# Altium project Cell-Sentinel.PrjPcb
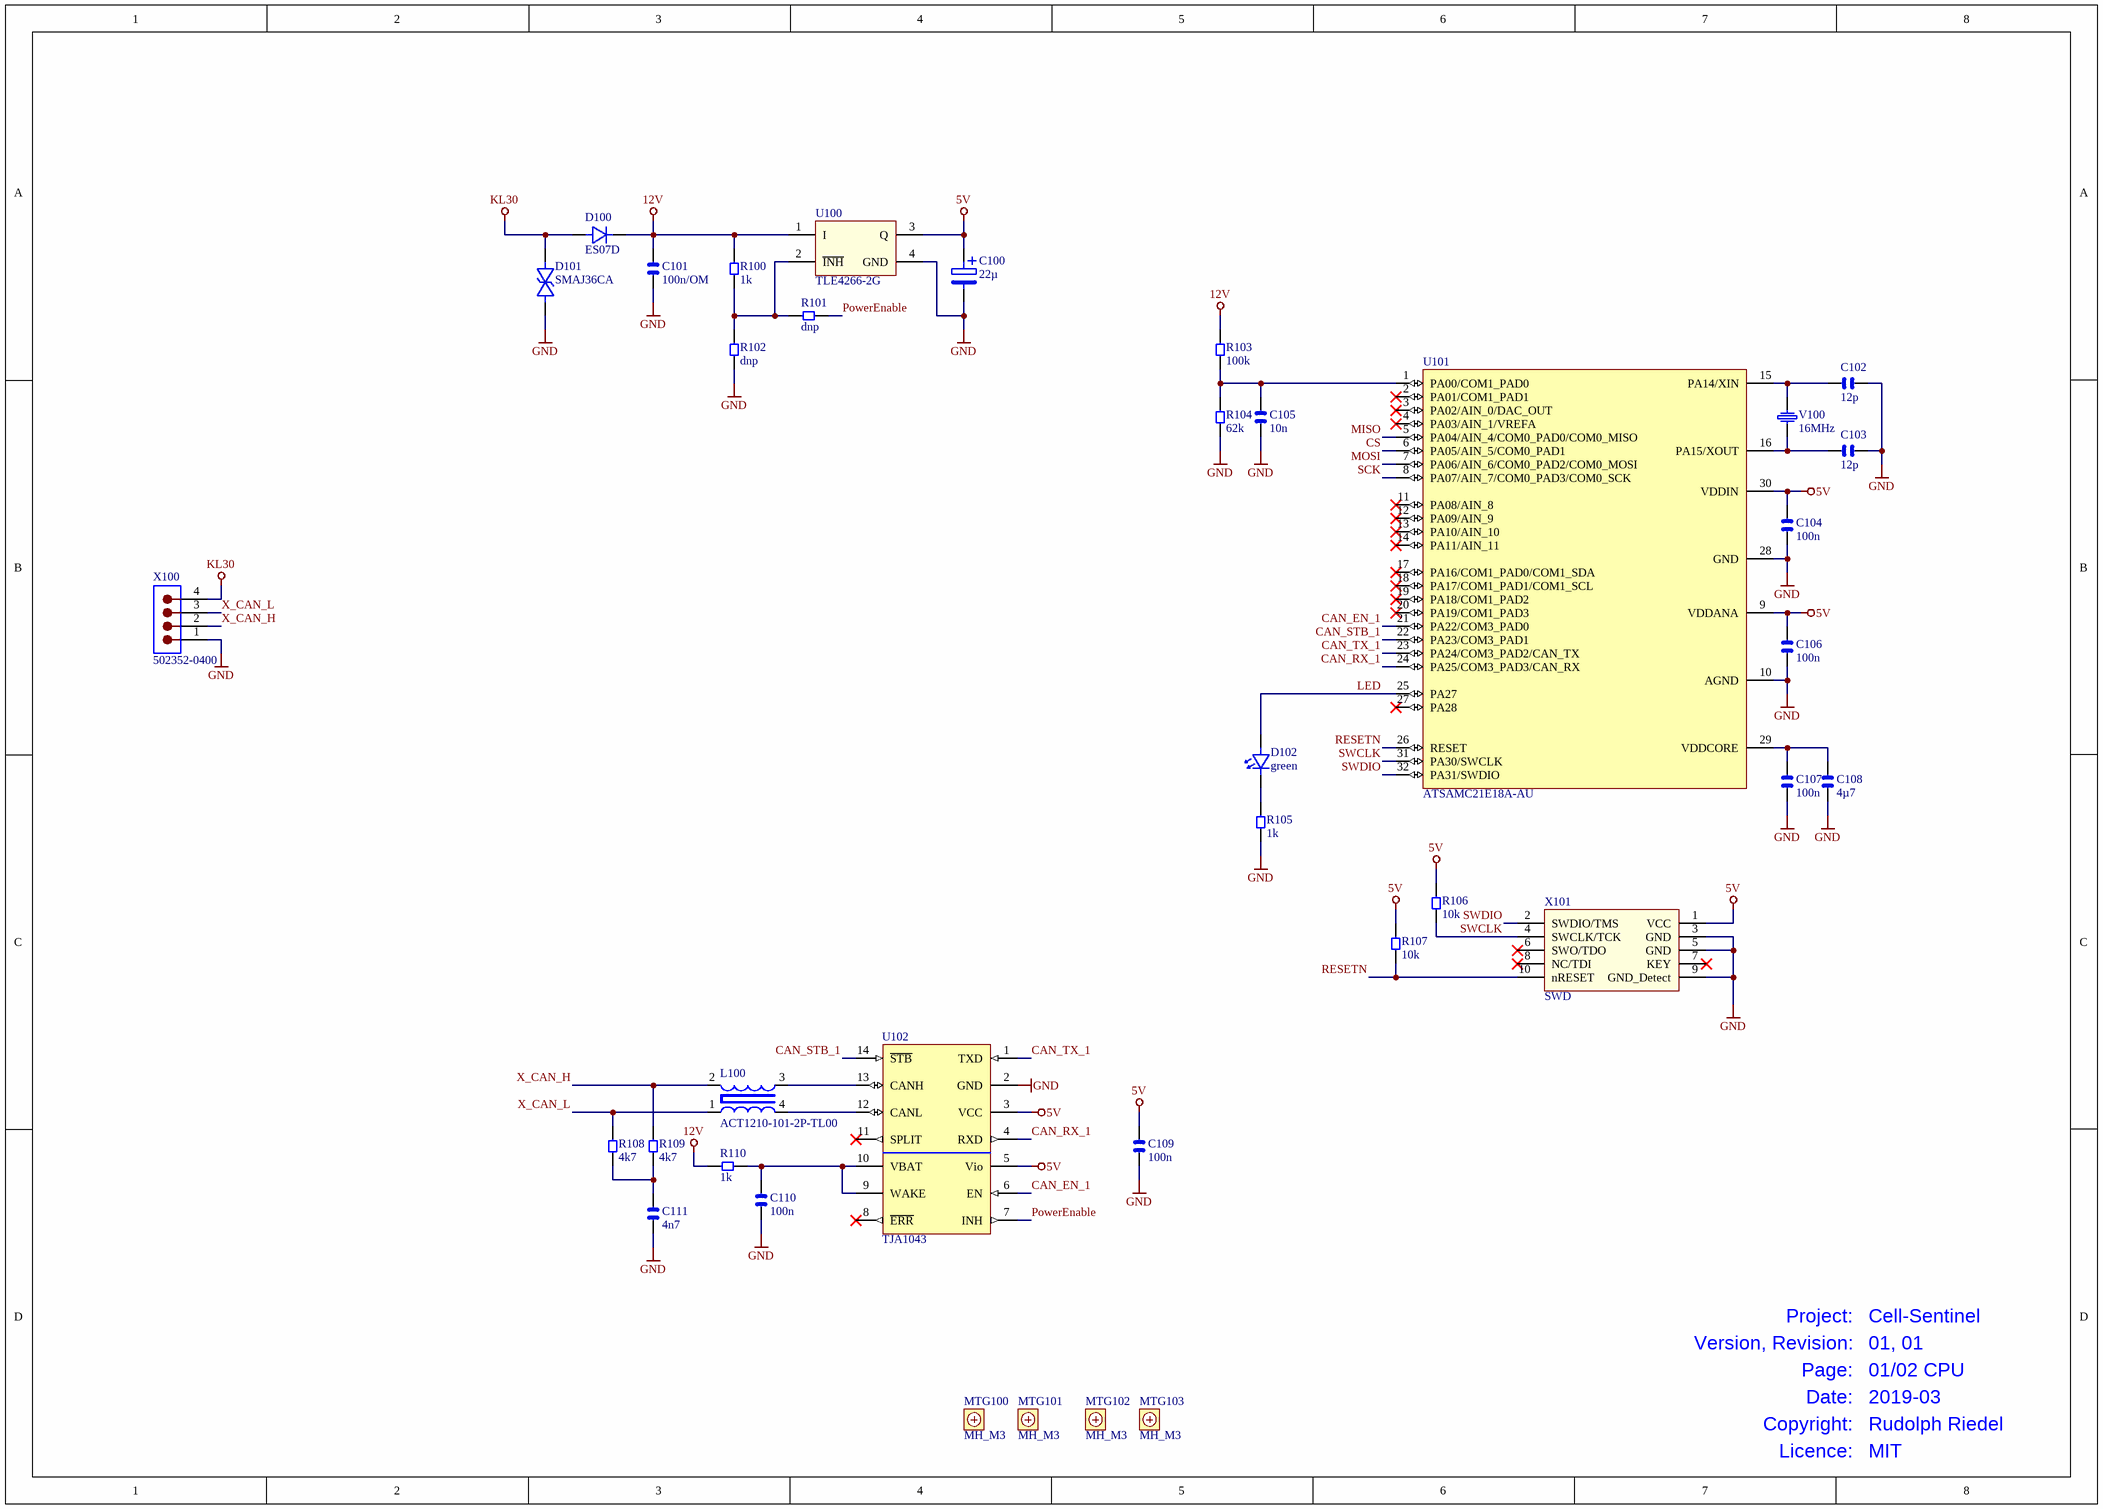
[diagram p0: 01_CPU.SchDoc]
2 sheets, 118 parts. Net scope: global (net labels, ports and power ports of the same name join across sheets).
Board file: CS_01-01.PcbDoc
Sheets:
  01_CPU.SchDoc
  02_Cell_Frontend.SchDoc

## Sheet 01_CPU.SchDoc: Sheet Description
size A3; Organization: Organization; Address1: Address1; Address2: Address2; Address3: Address3; Address4: Address4; DocumentNumber: 1; Revision: 0; SheetNumber: 1; SheetTotal: 2; PageSetup: Record=PageOptions|CenterHorizontal=True|CenterVertical=True|PrintScale=1.00|XCorrection=1.00|YCorrection=1.00|PrintKind=1|BorderSize=5000000|LeftOffset=0|BottomOffset=0|Orientation=2|PaperLength=1000|PaperWidth=1000|Scale=100|PaperSource=7|PrintQuality=-4|MediaType=1|DitherType=10|PaperKind=A3|PrintScaleMode=0

### Parts
C100  22µ  [CAPMP3528X21N]
C101  100n/OM  [CAPC2012X14L]
C102  12p  [CAPC2012X14L]
C103  12p  [CAPC2012X14L]
C104  100n  [CAPC1608X09L]
C105  10n  [CAPC2012X14L]
C106  100n  [CAPC1608X09L]
C107  100n  [CAPC1608X09L]
C108  4µ7  [CAPC2012X14L]
C109  100n  [CAPC2012X14L]
C110  100n  [CAPC2012X14L]
C111  4n7  [CAPC2012X14L]
D100  ES07D  [DIOM2818X11N]
D101  SMAJ36CA  [DIOM5226X23N]
D102  green  [DIOC2012X10N]
L100  ACT1210-101-2P-TL00  [ACT1210]
MTG100  MH_M3  [HOLE_3_2MM]  (no BOM)
MTG101  MH_M3  [HOLE_3_2MM]  (no BOM)
MTG102  MH_M3  [HOLE_3_2MM]  (no BOM)
MTG103  MH_M3  [HOLE_3_2MM]  (no BOM)
R100  1k  [RESC2012X06L]
R101  dnp  [RESC2012X06L]
R102  dnp  [RESC2012X06L]
R103  100k  [RESC2012X06L]
R104  62k  [RESC2012X06L]
R105  1k  [RESC2012X06L]
R106  10k  [RESC2012X06L]
R107  10k  [RESC2012X06L]
R108  4k7  [RESC3216X07N]
R109  4k7  [RESC3216X07N]
R110  1k  [RESC2012X06L]
U100  TLE4266-2G  [SOT230P700X180-4N]
U101  ATSAMC21E18A-AU  [TQFP80P900X900X120-32N]
U102  TJA1043  [SOIC127P600X175-14N]
V100  16MHz  [NX3225Gx]
X100  502352-0400  [502352-0400]
X101  SWD  [FTSH-105-01-L-DV-K]

### Nets
5V: C100.1 C104.2 C106.2 C109.2 R106.2 R107.2 U100.3(Q) U101.9(VDDANA) U101.30(VDDIN) U102.3(VCC) U102.5(Vio) X101.1(VCC)
12V: C101.2 D100.1 R100.2 R103.2 R110.1 U100.1(I)
GND: C100.2 C101.1 C102.2 C103.2 C104.1 C105.1 C106.1 C107.1 C108.1 C109.1 C110.1 C111.1 D101.1 R102.1 R104.1 R105.1 U100.4(GND) U101.10(AGND) U101.28(GND) U102.2(GND) X100.1 X101.3(GND) X101.5(GND) X101.9(GND_Detect)
KL30: D100.2 D101.2 X100.4
CAN_EN_1: U101.21(PA22/COM3_PAD0) U102.6(EN)
CAN_RX_1: U101.24(PA25/COM3_PAD3/CAN_RX) U102.4(RXD)
CAN_STB_1: U101.22(PA23/COM3_PAD1) U102.14(~{STB})
CAN_TX_1: U101.23(PA24/COM3_PAD2/CAN_TX) U102.1(TXD)
CS: U101.6(PA05/AIN_5/COM0_PAD1)
LED: D102.2 U101.25(PA27)
MISO: U101.5(PA04/AIN_4/COM0_PAD0/COM0_MISO)
MOSI: U101.7(PA06/AIN_6/COM0_PAD2/COM0_MOSI)
PowerEnable: R101.1 U102.7(INH)
RESETN: R107.1 U101.26(RESET) X101.10(nRESET)
SCK: U101.8(PA07/AIN_7/COM0_PAD3/COM0_SCK)
SWCLK: R106.1 U101.31(PA30/SWCLK) X101.4(SWCLK/TCK)
SWDIO: U101.32(PA31/SWDIO) X101.2(SWDIO/TMS)
X_CAN_H: L100.2 R109.2 X100.2
X_CAN_L: L100.1 R108.2 X100.3
NetC102_1: C102.1 U101.15(PA14/XIN) V100.2
NetC103_1: C103.1 U101.16(PA15/XOUT) V100.1
NetC105_2: C105.2 R103.1 R104.2 U101.1(PA00/COM1_PAD0)
NetC107_2: C107.2 C108.2 U101.29(VDDCORE)
NetC110_2: C110.2 R110.2 U102.9(WAKE) U102.10(VBAT)
NetC111_2: C111.2 R108.1 R109.1
NetD102_1: D102.1 R105.2
NetL100_3: L100.3 U102.13(CANH)
NetL100_4: L100.4 U102.12(CANL)
NetR100_1: R100.1 R101.2 R102.2 U100.2(~{INH})

Not connected (* = marked no-connect by the designer): U101 2(PA01/COM1_PAD1)* 3(PA02/AIN_0/DAC_OUT)* 4(PA03/AIN_1/VREFA)* 11(PA08/AIN_8)* 12(PA09/AIN_9)* 13(PA10/AIN_10)* 14(PA11/AIN_11)* 17(PA16/COM1_PAD0/COM1_SDA)* 18(PA17/COM1_PAD1/COM1_SCL)* 19(PA18/COM1_PAD2)* 20(PA19/COM1_PAD3)* 27(PA28)*; U102 8(~{ERR})* 11(SPLIT)*; X101 6(SWO/TDO)* 7(KEY)* 8(NC/TDI)*

### Notes on the sheet
- Project:
- Cell-Sentinel
- Version, Revision:
- Page:
- 01, 01
- 01/02 CPU
- Date:
- Copyright:
- Licence:
- 2019-03
- Rudolph Riedel
- MIT

### Library data of the parts
C100 = CAPMP_B: Tantalkondensator SMD Bauform B; Ersteller: rriedel; Freigabe: tested; Kategorie: generisch; Unterart: gepolt; Part Number: CAPMP_B; Value: 22µ; Bauteilart: Kondensator; PackageDescription: Tantal B
C101-C103 C105 C108-C111 = CAPC_0805: 0805 Chip Capacitor; Ersteller: rriedel; Freigabe: tested; Bauteilart: Kondensator; Kategorie: generisch; Unterart: ungepolt; Part Number: CAPC_0805; PackageDescription: 0805
  C101: Value: 100n/OM
  C102 C103: Value: 12p
  C105: Value: 10n
  C108: Value: 4µ7
  C109 C110: Value: 100n
  C111: Value: 4n7
C104 C106 C107 = CAPC_0603: 0603 Chip Capacitor; Ersteller: rriedel; Freigabe: tested; Bauteilart: Kondensator; Kategorie: generisch; Unterart: ungepolt; Part Number: CAPC_0603; Value: 100n; PackageDescription: 0603
D100 = ES07D: Ultrafast Rectifier Surface Mount,  IF 0.5A, VR 100V, DO-219AB, AEC-Q101; Ersteller: rriedel; Freigabe: tested; Bauteilart: Diode; Kategorie: Bauteil; Hersteller: Vishay; Part Number: ES07D; Value: ES07D; Erstelldatum: 09.10.2013; Unterart: Rectifier; PackageDescription: DO-219AB; Hersteller_Code_1: ES07D
D101 = SMAJ36CA: Transildiode Bidirectional 400W 36V; Ersteller: rriedel; Freigabe: tested; Bauteilart: Diode; Kategorie: Bauteil; Hersteller: DIODES; Hersteller_Code_1: SMAJ36CA-13-F; Part Number: SMAJ36CA; Value: SMAJ36CA; Erstelldatum: 15.09.2016; Unterart: Transil; PackageDescription: SMA
D102 = LED_0805: LED, 0805; Ersteller: rriedel; Freigabe: tested; Bauteilart: Diode; Kategorie: generisch; Part Number: LED_0805; Value: green; Erstelldatum: 25.07.2017; PackageDescription: 0805
L100 = ACT1210-101-2P-TL00: Common Mode Filter,  -50°C ... +150°C, AEC-Q200; Ersteller: rriedel; Freigabe: tested; Bauteilart: Spule; Kategorie: Bauteil; Hersteller: TDK; Part Number: ACT1210-101-2P-TL00; Value: ACT1210-101-2P-TL00; Erstelldatum: 17.10.2017; Unterart: Filter; PackageDescription: 3225; Hersteller_Code_1: ACT1210-101-2P-TL00; Distributor_1: Farnell; Distributor_1_Part_Number: 2442838; Distributor_2: Digi-Key; Distributor_2_Part_Number: 445-172386-1-ND
MTG100-MTG103 = MH_M3: Mounting-Hole for M3 screws; Ersteller: rriedel; Freigabe: tested; Bauteilart: Mechanic; Kategorie: No_Bom; Unterart: Holes; Part Number: MH_M3; Value: MH_M3; Erstelldatum: 13.05.2018
R100-R107 R110 = RESC_0805: 0805 Chip Resistor; Ersteller: rriedel; Freigabe: tested; Bauteilart: Widerstand; Kategorie: generisch; Unterart: Standard; Part Number: RESC_0805; PackageDescription: 0805
  R100 R105 R110: Value: 1k
  R101 R102: Value: dnp
  R103: Value: 100k
  R104: Value: 62k
  R106 R107: Value: 10k
R108 R109 = RESC_1206: 1206 Chip Resistor; Ersteller: rriedel; Freigabe: tested; Bauteilart: Widerstand; Kategorie: generisch; Unterart: Standard; Part Number: RESC_1206; Value: 4k7; PackageDescription: 1206
U100 = TLE4266-2G: 150 mA LDO, Vout = 5,0V, 2%, Enable; Ersteller: rriedel; Freigabe: tested; Bauteilart: IC; Kategorie: Bauteil; Unterart: Linear-Regulators; Hersteller: Infineon; Part Number: TLE4266-2G; Value: TLE4266-2G; Erstelldatum: 31.03.2019; PackageDescription: SOT223; Hersteller_Code_1: TLE4266-2G; Distributor_1: Digi-Key; Distributor_2: Farnell
U101 = ATSAMC21E18A-AU: 32-bit Microcontroller, 48MHz Cortex M0, 256k FLASH,  1x CAN-FD, -40…85°C; Ersteller: rriedel; Freigabe: tested; Bauteilart: MikroController; Kategorie: Bauteil; Unterart: 32bit Microchip; Hersteller: Microchip; Part Number: ATSAMC21E18A-AU; Value: ATSAMC21E18A-AU; Erstelldatum: 11.08.2018; PackageDescription: TQFP32; Hersteller_Code_1: ATSAMC21E18A-AU
U102 = TJA1043T: HS Can Transceiver with wake-up Tvj= -40 to 150 °C; Ersteller: rriedel; Freigabe: tested; Bauteilart: IC; Kategorie: Bauteil; Unterart: Interface; Hersteller: NXP; Part Number: TJA1043T; Value: TJA1043; Erstelldatum: 10.10.2012; PackageDescription: SO14; Hersteller_Code_1: TJA1043T
V100 = NX3225GB-16.000000MHZ: 16.000MHz Crystal SMD, 3.2x2.5mm, 8pF, 50ppm,  -40..+150°C; Ersteller: rriedel; Freigabe: tested; Bauteilart: Quarz; Kategorie: Bauteil; Unterart: NX3225GB automotive; Hersteller: NDK; Hersteller_Code_1: NX3225GB-16M-STD-CRA-2; Part Number: NX3225GB-16.000000MHZ; Value: 16MHz; Erstelldatum: 22.10.2015; PackageDescription: NX3225Gx 3,2mm x 2,5mm; Distributor_1: Digi-Key; Distributor_1_Part_Number: 644-1233-1-ND; Distributor_2: Frischer
X100 = Molex-502352-0400: Molex PCB Header DuraClik 4pins, SMD, -40°C to +105°C; Ersteller: rriedel; Freigabe: tested; Bauteilart: Steckverbinder; Kategorie: Bauteil; Unterart: Molex DuraClik; Part Number: Molex-502352-0400; Value: 502352-0400; Erstelldatum: 23.11.2017; PackageDescription: DuraClik-4; Hersteller: Molex; Hersteller_Code_1: 502352-0400; Distributor_1: Farnell; Distributor_1_Part_Number: 2067041
X101 = SWD: ARM Debug-Header 2x5 1,27 mm; Ersteller: rriedel; Freigabe: tested; Bauteilart: Steckverbinder; Kategorie: Bauteil; Unterart: Debug; Part Number: SWD; Value: SWD; Erstelldatum: 12.08.2018; PackageDescription: 2x5 1,27mm

## Sheet 02_Cell_Frontend.SchDoc: Sheet Description
size A3; Organization: Organization; Address1: Address1; Address2: Address2; Address3: Address3; Address4: Address4; DocumentNumber: 1; Revision: 0; SheetNumber: 2; SheetTotal: 2; PageSetup: Record=PageOptions|CenterHorizontal=True|CenterVertical=True|PrintScale=1.00|XCorrection=1.00|YCorrection=1.00|PrintKind=1|BorderSize=5000000|LeftOffset=0|BottomOffset=0|Orientation=2|PaperLength=1000|PaperWidth=1000|Scale=100|PaperSource=7|PrintQuality=-4|MediaType=1|DitherType=10|PaperKind=A3|PrintScaleMode=0
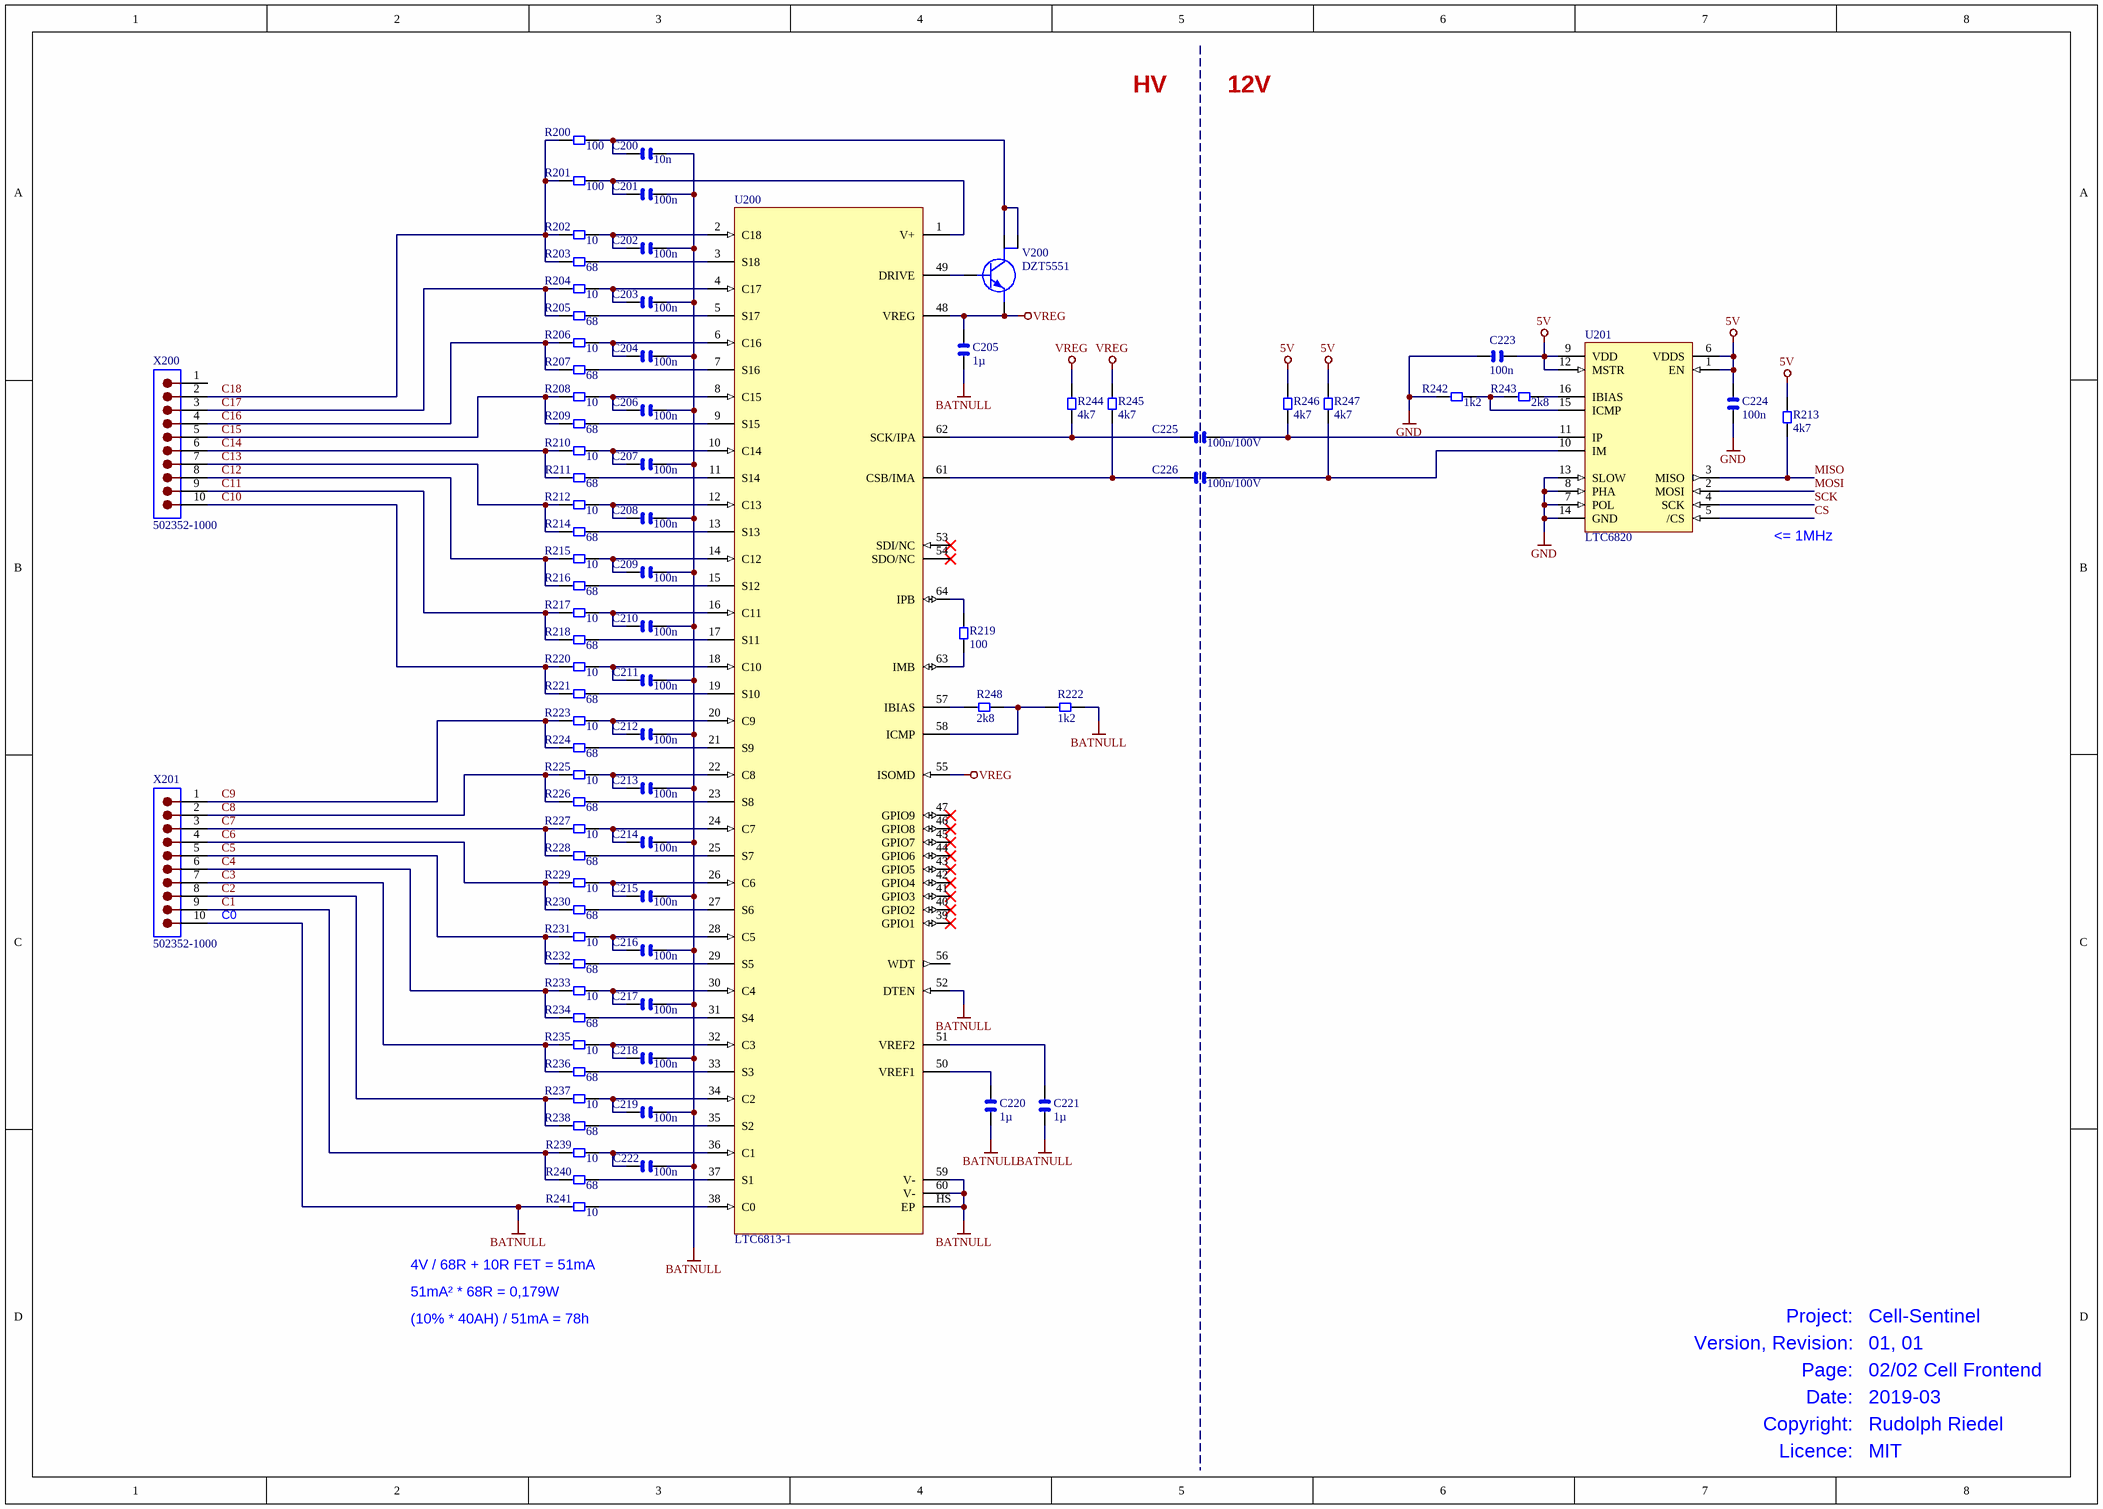
[diagram p1: 02_Cell_Frontend.SchDoc]

### Parts
C200  10n  [CAPC1608X09L]
C201  100n  [CAPC1608X09L]
C202  100n  [CAPC1608X09L]
C203  100n  [CAPC1608X09L]
C204  100n  [CAPC1608X09L]
C205  1µ  [CAPC2012X14L]
C206  100n  [CAPC1608X09L]
C207  100n  [CAPC1608X09L]
C208  100n  [CAPC1608X09L]
C209  100n  [CAPC1608X09L]
C210  100n  [CAPC1608X09L]
C211  100n  [CAPC1608X09L]
C212  100n  [CAPC1608X09L]
C213  100n  [CAPC1608X09L]
C214  100n  [CAPC1608X09L]
C215  100n  [CAPC1608X09L]
C216  100n  [CAPC1608X09L]
C217  100n  [CAPC1608X09L]
C218  100n  [CAPC1608X09L]
C219  100n  [CAPC1608X09L]
C220  1µ  [CAPC2012X14L]
C221  1µ  [CAPC2012X14L]
C222  100n  [CAPC1608X09L]
C223  100n  [CAPC2012X14L]
C224  100n  [CAPC2012X14L]
C225  100n/100V  [CAPC1608X09L]
C226  100n/100V  [CAPC1608X09L]
R200  100  [RESC1608X06L]
R201  100  [RESC1608X06L]
R202  10  [RESC1608X06L]
R203  68  [RESC1608X06L]
R204  10  [RESC1608X06L]
R205  68  [RESC1608X06L]
R206  10  [RESC1608X06L]
R207  68  [RESC1608X06L]
R208  10  [RESC1608X06L]
R209  68  [RESC1608X06L]
R210  10  [RESC1608X06L]
R211  68  [RESC1608X06L]
R212  10  [RESC1608X06L]
R213  4k7  [RESC1608X06L]
R214  68  [RESC1608X06L]
R215  10  [RESC1608X06L]
R216  68  [RESC1608X06L]
R217  10  [RESC1608X06L]
R218  68  [RESC1608X06L]
R219  100  [RESC1608X06L]
R220  10  [RESC1608X06L]
R221  68  [RESC1608X06L]
R222  1k2  [RESC1608X06L]
R223  10  [RESC1608X06L]
R224  68  [RESC1608X06L]
R225  10  [RESC1608X06L]
R226  68  [RESC1608X06L]
R227  10  [RESC1608X06L]
R228  68  [RESC1608X06L]
R229  10  [RESC1608X06L]
R230  68  [RESC1608X06L]
R231  10  [RESC1608X06L]
R232  68  [RESC1608X06L]
R233  10  [RESC1608X06L]
R234  68  [RESC1608X06L]
R235  10  [RESC1608X06L]
R236  68  [RESC1608X06L]
R237  10  [RESC1608X06L]
R238  68  [RESC1608X06L]
R239  10  [RESC1608X06L]
R240  68  [RESC1608X06L]
R241  10  [RESC1608X06L]
R242  1k2  [RESC1608X06L]
R243  2k8  [RESC1608X06L]
R244  4k7  [RESC1608X06L]
R245  4k7  [RESC1608X06L]
R246  4k7  [RESC1608X06L]
R247  4k7  [RESC1608X06L]
R248  2k8  [RESC1608X06L]
U200  LTC6813-1  [TSQFP50P1200X1200X120-HS-65N]
U201  LTC6820  [TSSOP50P490X110_16N]
V200  DZT5551  [SOT230P700X180-4N]
X200  502352-1000  [502352-1000]
X201  502352-1000  [502352-1000]

### Nets
5V: C223.1 C224.2 R213.2 R246.2 R247.2 U201.1(EN) U201.6(VDDS) U201.9(VDD) U201.12(MSTR)
BATNULL: C200.2 C201.2 C202.2 C203.2 C204.2 C205.1 C206.2 C207.2 C208.2 C209.2 C210.2 C211.2 C212.2 C213.2 C214.2 C215.2 C216.2 C217.2 C218.2 C219.2 C220.1 C221.1 C222.2 R222.1 R241.1 U200.52(DTEN) U200.59(V-) U200.60(V-) U200.HS(EP) X201.10
GND: C223.2 C224.1 R242.2 U201.7(POL) U201.8(PHA) U201.13(SLOW) U201.14(GND)
VREG: C205.2 R244.2 R245.2 U200.48(VREG) U200.55(ISOMD) V200.3(E)
C1: R239.1 R240.1 X201.9
C2: R237.1 R238.1 X201.8
C3: R235.1 R236.1 X201.7
C4: R233.1 R234.1 X201.6
C5: R231.1 R232.1 X201.5
C6: R229.1 R230.1 X201.4
C7: R227.1 R228.1 X201.3
C8: R225.1 R226.1 X201.2
C9: R223.1 R224.1 X201.1
C10: R220.1 R221.1 X200.10
C11: R217.1 R218.1 X200.9
C12: R215.1 R216.1 X200.8
C13: R212.1 R214.1 X200.7
C14: R210.1 R211.1 X200.6
C15: R208.1 R209.1 X200.5
C16: R206.1 R207.1 X200.4
C17: R204.1 R205.1 X200.3
C18: R200.1 R201.1 R202.1 R203.1 X200.2
CS: U201.5(/CS)
MISO: R213.1 U201.3(MISO)
MOSI: U201.2(MOSI)
SCK: U201.4(SCK)
NetC200_1: C200.1 R200.2 V200.2(C) V200.4(C)
NetC201_1: C201.1 R201.2 U200.1(V+)
NetC202_1: C202.1 R202.2 U200.2(C18)
NetC203_1: C203.1 R204.2 U200.4(C17)
NetC204_1: C204.1 R206.2 U200.6(C16)
NetC206_1: C206.1 R208.2 U200.8(C15)
NetC207_1: C207.1 R210.2 U200.10(C14)
NetC208_1: C208.1 R212.2 U200.12(C13)
NetC209_1: C209.1 R215.2 U200.14(C12)
NetC210_1: C210.1 R217.2 U200.16(C11)
NetC211_1: C211.1 R220.2 U200.18(C10)
NetC212_1: C212.1 R223.2 U200.20(C9)
NetC213_1: C213.1 R225.2 U200.22(C8)
NetC214_1: C214.1 R227.2 U200.24(C7)
NetC215_1: C215.1 R229.2 U200.26(C6)
NetC216_1: C216.1 R231.2 U200.28(C5)
NetC217_1: C217.1 R233.2 U200.30(C4)
NetC218_1: C218.1 R235.2 U200.32(C3)
NetC219_1: C219.1 R237.2 U200.34(C2)
NetC220_2: C220.2 U200.50(VREF1)
NetC221_2: C221.2 U200.51(VREF2)
NetC222_1: C222.1 R239.2 U200.36(C1)
NetC225_1: C225.1 R244.1 U200.62(SCK/IPA)
NetC225_2: C225.2 R246.1 U201.11(IP)
NetC226_1: C226.1 R245.1 U200.61(CSB/IMA)
NetC226_2: C226.2 R247.1 U201.10(IM)
NetR203_2: R203.2 U200.3(S18)
NetR205_2: R205.2 U200.5(S17)
NetR207_2: R207.2 U200.7(S16)
NetR209_2: R209.2 U200.9(S15)
NetR211_2: R211.2 U200.11(S14)
NetR214_2: R214.2 U200.13(S13)
NetR216_2: R216.2 U200.15(S12)
NetR218_2: R218.2 U200.17(S11)
NetR219_1: R219.1 U200.64(IPB)
NetR219_2: R219.2 U200.63(IMB)
NetR221_2: R221.2 U200.19(S10)
NetR222_2: R222.2 R248.2 U200.58(ICMP)
NetR224_2: R224.2 U200.21(S9)
NetR226_2: R226.2 U200.23(S8)
NetR228_2: R228.2 U200.25(S7)
NetR230_2: R230.2 U200.27(S6)
NetR232_2: R232.2 U200.29(S5)
NetR234_2: R234.2 U200.31(S4)
NetR236_2: R236.2 U200.33(S3)
NetR238_2: R238.2 U200.35(S2)
NetR240_2: R240.2 U200.37(S1)
NetR241_2: R241.2 U200.38(C0)
NetR242_1: R242.1 R243.1 U201.15(ICMP)
NetR243_2: R243.2 U201.16(IBIAS)
NetR248_1: R248.1 U200.57(IBIAS)
NetU200_49: U200.49(DRIVE) V200.1(B)

Not connected (* = marked no-connect by the designer): U200 39(GPIO1)* 40(GPIO2)* 41(GPIO3)* 42(GPIO4)* 43(GPIO5)* 44(GPIO6)* 45(GPIO7)* 46(GPIO8)* 47(GPIO9)* 53(SDI/NC)* 54(SDO/NC)* 56(WDT); X200 1

### Notes on the sheet
- HV
- 12V
- <= 1MHz
- (near X201) C0
- 4V / 68R + 10R FET = 51mA
- 51mA² * 68R = 0,179W
- (10% * 40AH) / 51mA = 78h
- Project:
- Cell-Sentinel
- Version, Revision:
- Page:
- 01, 01
- 02/02 Cell Frontend
- Date:
- Copyright:
- Licence:
- 2019-03
- Rudolph Riedel
- MIT

### Library data of the parts
C200-C204 C206-C219 C222 C225 C226 = CAPC_0603: as C104 on sheet 01_CPU; Part Number: CAPC_0603; PackageDescription: 0603
  C200: Value: 10n
  C201-C204 C206-C219 C222: Value: 100n
  C225 C226: Value: 100n/100V
C205 C220 C221 C223 C224 = CAPC_0805: as C101 on sheet 01_CPU; Part Number: CAPC_0805; PackageDescription: 0805
  C205 C220 C221: Value: 1µ
  C223 C224: Value: 100n
R200-R248 = RESC_0603: 0603 Chip Resistor; Ersteller: rriedel; Freigabe: tested; Bauteilart: Widerstand; Kategorie: generisch; Unterart: Standard; Part Number: RESC_0603; PackageDescription: 0603
  R200 R201 R219: Value: 100
  R202 R204 R206 R208 R210 R212 R215 R217 R220 R223 R225 R227 R229 R231 R233 R235 R237 R239 R241: Value: 10
  R203 R205 R207 R209 R211 R214 R216 R218 R221 R224 R226 R228 R230 R232 R234 R236 R238 R240: Value: 68
  R213 R244-R247: Value: 4k7
  R222 R242: Value: 1k2
  R243 R248: Value: 2k8
U200 = LTC6813-1: Battery Cell Monitor; Ersteller: rriedel; Freigabe: new; Bauteilart: IC; Kategorie: Bauteil; Hersteller: Analog; Part Number: LTC6813-1; Value: LTC6813-1; Erstelldatum: 14.12.2018; Unterart: Battery; PackageDescription: TQFP64_HS-0.5mm; Hersteller_Code_1: LTC6813-1
U201 = LTC6820: isoSPI Interface; Ersteller: rriedel; Freigabe: new; Bauteilart: IC; Kategorie: Bauteil; Hersteller: Analog; Part Number: LTC6820; Value: LTC6820; Erstelldatum: 20.12.2018; Unterart: Interface; PackageDescription: MSOP16; Hersteller_Code_1: LTC6820
V200 = DZT5551: NPN, VCE= 160V, IC=600mA, SOT223; Ersteller: rriedel; Freigabe: tested; Bauteilart: Transistor; Kategorie: Bauteil; Hersteller: Diodes; Part Number: DZT5551; Value: DZT5551; Erstelldatum: 31.03.2019; Unterart: NPN; PackageDescription: SOT223; Hersteller_Code_1: DZT5551; Distributor_1: Digi-Key; Distributor_1_Part_Number: DZT5551DICT-ND
X200 X201 = Molex-502352-1000: Molex PCB Header DuraClik 10pins, SMD, -40°C to +105°C; Ersteller: rriedel; Freigabe: new; Bauteilart: Steckverbinder; Kategorie: Bauteil; Unterart: Molex DuraClik; Part Number: Molex-502352-1000; Value: 502352-1000; Erstelldatum: 16.12.2018; PackageDescription: DuraClik-10; Hersteller: Molex; Hersteller_Code_1: 502352-1000

## Nets that join several sheets
5V: 01_CPU (12 pins), 02_Cell_Frontend (9 pins)
GND: 01_CPU (24 pins), 02_Cell_Frontend (7 pins)
CS: 01_CPU (U101.6), 02_Cell_Frontend (U201.5)
MISO: 01_CPU (U101.5), 02_Cell_Frontend (R213.1 U201.3)
MOSI: 01_CPU (U101.7), 02_Cell_Frontend (U201.2)
SCK: 01_CPU (U101.8), 02_Cell_Frontend (U201.4)